# Altium schematic sheet 0_Overview.SchDoc: Overview
size A3; DocumentNumber: 1; SheetNumber: 1; SheetTotal: 6; PageSetup: Record=PageOptions|CenterHorizontal=True|CenterVertical=True|PrintScale=1.01|XCorrection=1.00|YCorrection=1.00|PrintKind=0|BorderSize=5000000|LeftOffset=0|BottomOffset=0|Orientation=2|PaperLength=1000|PaperWidth=1000|Scale=100|PaperSource=7|PrintQuality=-4|MediaType=1|DitherType=10|PaperKind=A3|PrintScaleMode=1
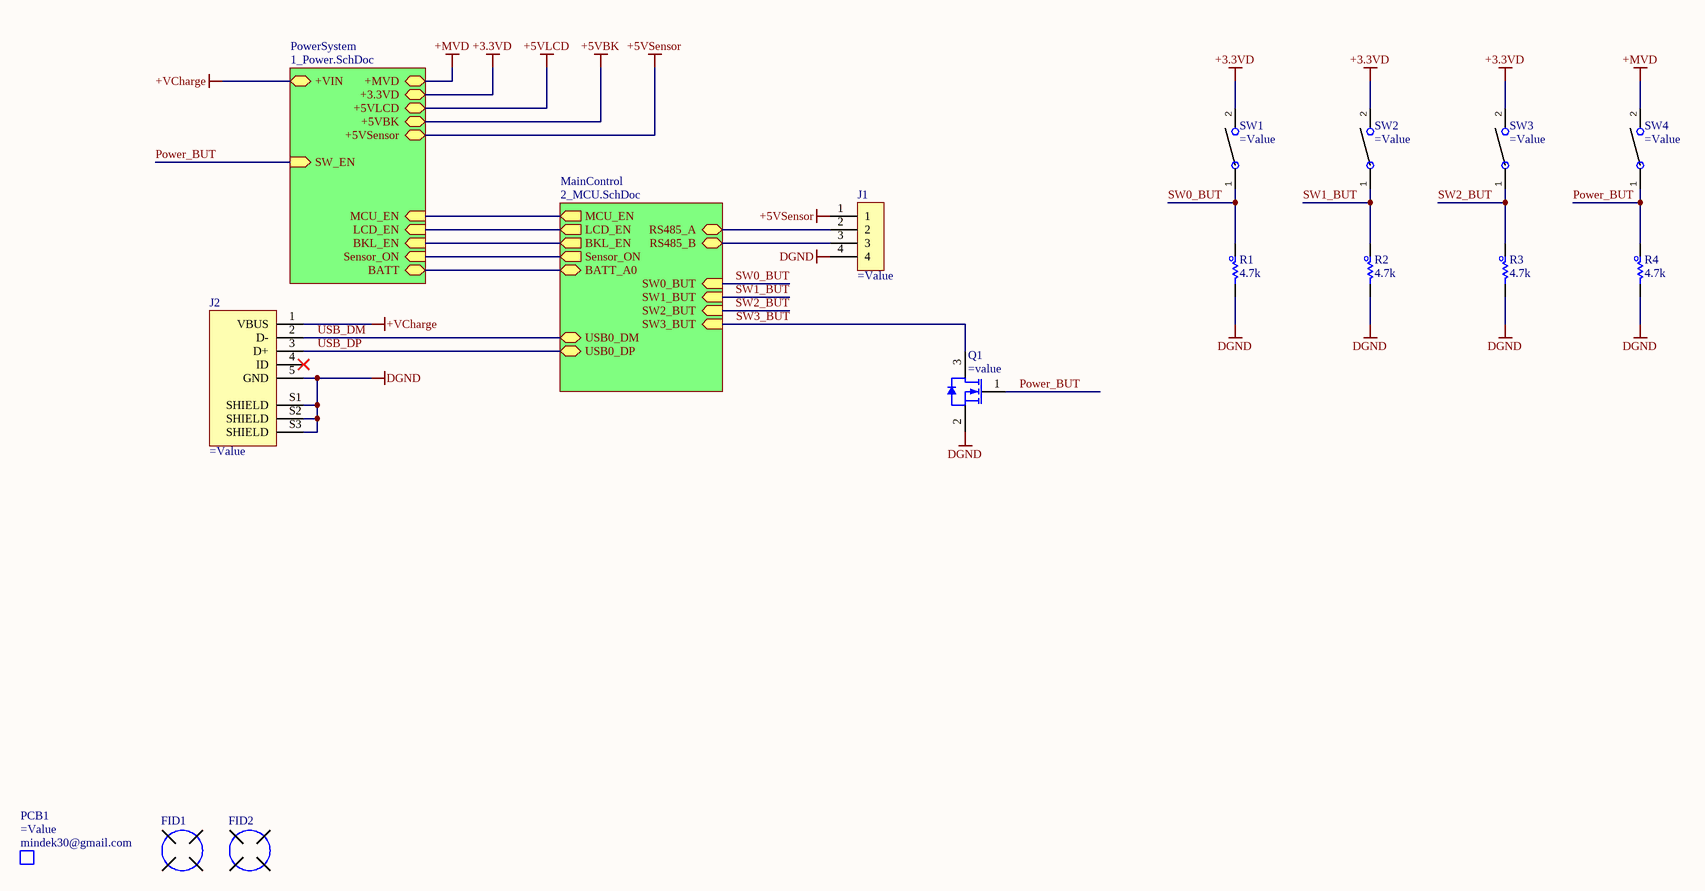
[diagram p0: 0_Overview.SchDoc]

## Parts
FID1  FIDUCIAL  [FID]  (value not drawn)  (no BOM)
FID2  FIDUCIAL  [FID]  (value not drawn)  (no BOM)
J1  (no value)  [CON_4P_Header]
J2  (no value)  [MOLEX_105133-0011]
PCB1  Manufacturer: mindek30@gmail.com  (mechanical)
Q1  (no value)  [SOT95P245X110-3M]
R1  4.7k  [R_0603]
R2  4.7k  [R_0603]
R3  4.7k  [R_0603]
R4  4.7k  [R_0603]
SW1  (no value)  [Tactile]
SW2  (no value)  [Tactile]
SW3  (no value)  [Tactile]
SW4  (no value)  [Tactile]

## Sub-sheets
MainControl = 2_MCU.SchDoc: BATT_A0 (bidir), RS485_A (bidir), RS485_B (bidir), USB0_DP (bidir), USB0_DM (bidir), MCU_EN (out), LCD_EN (out), BKL_EN (out), Sensor_ON (out), SW0_BUT (in), SW1_BUT (in), SW2_BUT (in), SW3_BUT (in)
PowerSystem = 1_Power.SchDoc: +3.3VD (bidir), +VIN (bidir), +5VLCD (bidir), +MVD (bidir), BATT (bidir), MCU_EN (in), LCD_EN (in), BKL_EN (in), +5VBK (bidir), Sensor_ON (in), +5VSensor (bidir), SW_EN (in)

## Nets
+3.3VD: SW1.2 SW2.2 SW3.2 ; sheet PowerSystem/+3.3VD
+5VBK: sheet PowerSystem/+5VBK
+5VLCD: sheet PowerSystem/+5VLCD
+5VSensor: J1.1 ; sheet PowerSystem/+5VSensor
+MVD: SW4.2 ; sheet PowerSystem/+MVD
+VCharge: J2.1(VBUS) ; sheet PowerSystem/+VIN
DGND: J1.4 J2.5(GND) J2.S1(SHIELD) J2.S2(SHIELD) J2.S3(SHIELD) Q1.2(S) R1.2 R2.2 R3.2 R4.2
Power_BUT: Q1.1(G) R4.1 SW4.1 ; sheet PowerSystem/SW_EN
SW0_BUT: R1.1 SW1.1 ; sheet MainControl/SW0_BUT
SW1_BUT: R2.1 SW2.1 ; sheet MainControl/SW1_BUT
SW2_BUT: R3.1 SW3.1 ; sheet MainControl/SW2_BUT
SW3_BUT: Q1.3(D) ; sheet MainControl/SW3_BUT
USB_DM: J2.2(D-) ; sheet MainControl/USB0_DM
USB_DP: J2.3(D+) ; sheet MainControl/USB0_DP
NetJ1_2: J1.2 ; sheet MainControl/RS485_A
NetJ1_3: J1.3 ; sheet MainControl/RS485_B
(unnamed): sheet MainControl/BATT_A0, sheet PowerSystem/BATT
(unnamed): sheet MainControl/MCU_EN, sheet PowerSystem/MCU_EN
(unnamed): sheet MainControl/LCD_EN, sheet PowerSystem/LCD_EN
(unnamed): sheet MainControl/BKL_EN, sheet PowerSystem/BKL_EN
(unnamed): sheet MainControl/Sensor_ON, sheet PowerSystem/Sensor_ON

Not connected (* = marked no-connect by the designer): J2 4(ID)*

## Notes on the sheet
- Title :
- Revision :
- ผู้จัดทำ:
- Size:
- A3
- Time:
- ผู้เขียน:
- บริษัท ยูนิเวอร์แซล ยูทีลิตี้ส์ จำกัด (มหาชน) เลขที่ 1 อาคาร อีสท์วอเตอร์ ชั้น 18 ซอยวิภาวดีรังสิต 5 แขวงจอมพล เขตจตุจักร กรุงเทพฯ 10900
  Tel : +662-272-1688
  Fax :+662-2721690-1
- -
- Sheet:
- of
- ผู้อำนวยการ
- ผู้ตรวจสอบ:
- Number:
- กรรมการผู้จัดการ:
- File:

## Library data of the parts
FID1 FID2 = FID_FIDUCIAL: Manufacturer: mindek30@gmail.com; Value2: Non SE; Value: Non SE; PartNumber: =PCB_PN+'_'+PCB_Rev; PartID: =PCB_Rev; PackageReference: Non SE; Value3: Non SE
J1 = CON_4P_Heder: Connector 4 position; PartNumber: *; PartID: *; Manufacturer: *; PackageReference: *; Value: *; Value2: *; Value3: *
J2 = CON_USBMiniB_TH: USB 2.0 1 Brick nogging 5 Female Micro-B SMD USB Connectors ROHS; PartNumber: 1051330011; Manufacturer: Molex; Value: 1051330011; PartID: C586226; PackageReference: *; Value2: *; Value3: *
PCB1 = PCB_Bare: BARE PCB; PartNumber: =PCB_PN+'_'+PCB_Rev; PackageReference: Non SE; PartID: =PCB_Rev; Value2: =JobFile_Title; Value: =PartNumber; Value3: =PCBA_PN+'_'+PCBA_Rev
Q1 = Q_NMOS_RK7002BMT116: MOSFET N-Channel 60V/250mA,0.2W; Manufacturer: ROHM; Value: RK7002BMT116; PackageReference: SOT23; PartID: 0176-0358-6; PartNumber: RK7002BMT116; Value3: *
R1-R4 = R_Resister: RES 4.7K OHM 5% 1/10W 0603; Manufacturer: Vishay Dale; PartNumber: CRCW06034K70JNEBC; Value2: 0.1W; Value: 4.7k; PackageReference: 0603; PartID: 541-CRCW06034K70JNEBCCT-ND; Value3: *
SW1-SW4 = SW_TAC_TH: SWITCH TACTILE SPST-NO 0.05A 50V; PartNumber: TC-0308-X-ROHS; Manufacturer: WEALTH METAL; Value: TC-0308-X-ROHS; PartID: 0171-0064-8; PackageReference: *; Value2: *; Value3: *